# Altium schematic sheet Sensors.SchDoc: Gimbal - Sensors
size Letter; DrawnBy: Lance Bantoto; Organization: UW Robotics; Address1: 200 University Avenue; Address2: Waterloo; Address3: Ontario; Address4: Canada N2L 3G6; SheetNumber: 4; SheetTotal: 5
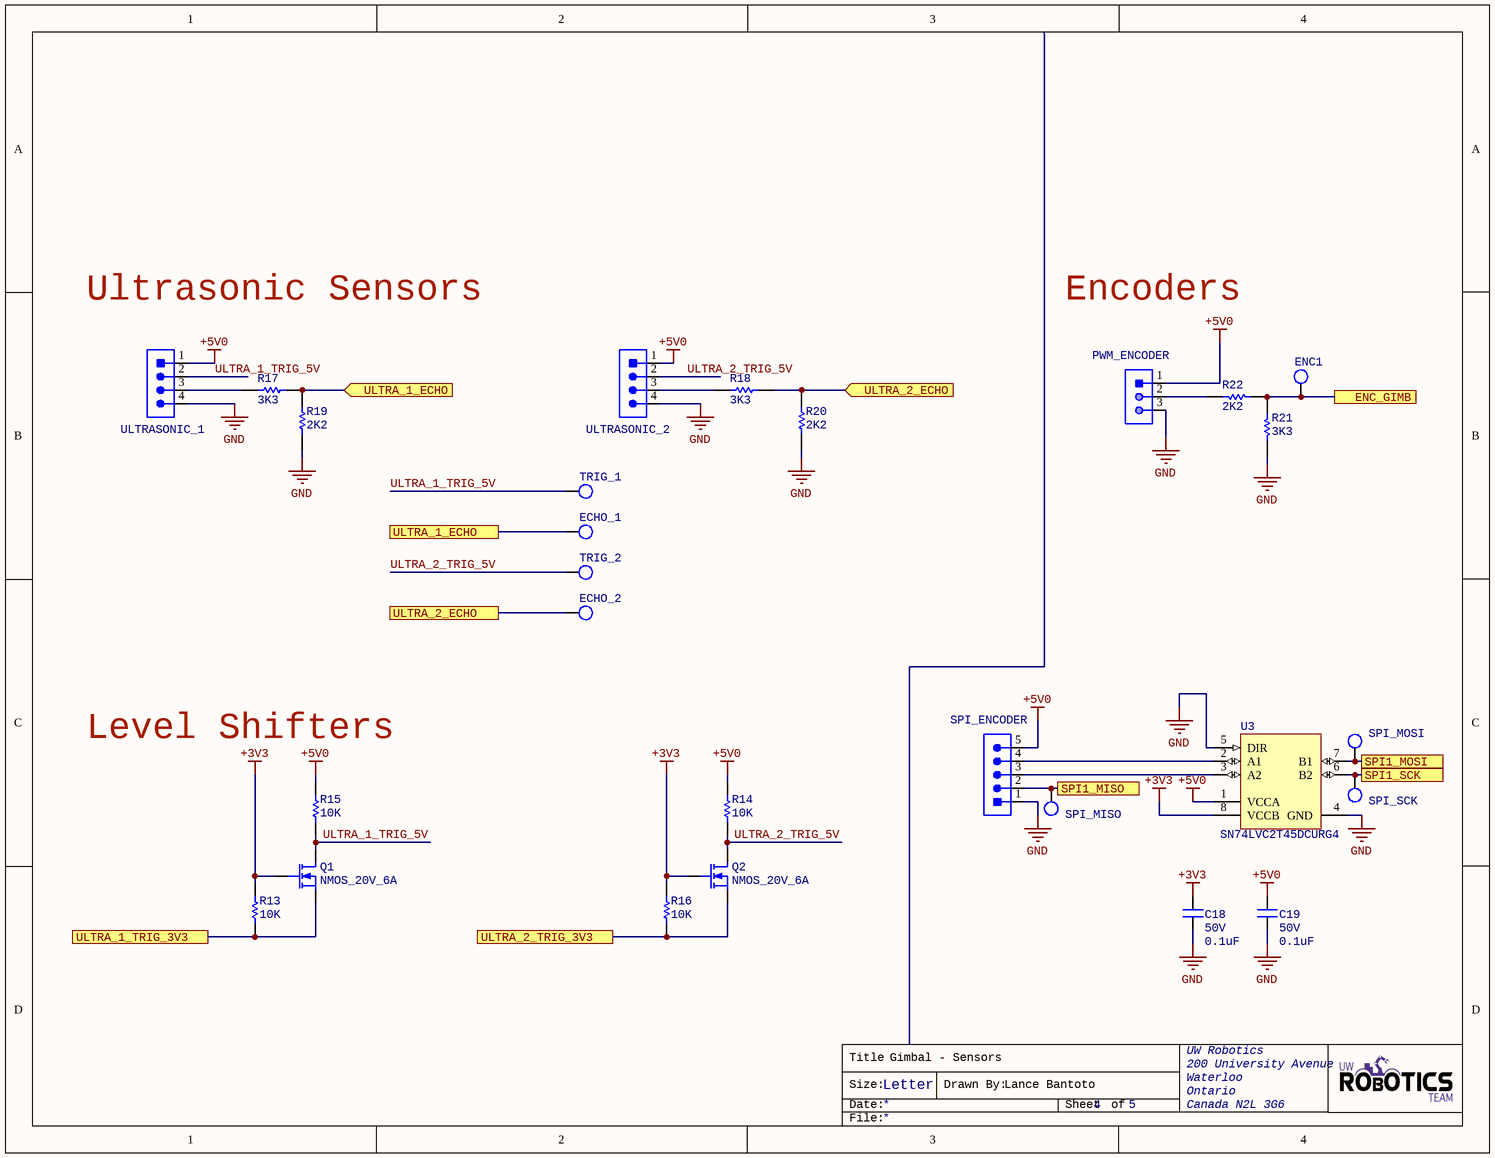
[diagram p0: Sensors.SchDoc]

## Parts
C18  value 0.1uF  Voltage Rating: 50V  [CAPC0603(1608)55_N]  (hidden comment: CAP_0.1uF_50V_0603)
C19  value 0.1uF  Voltage Rating: 50V  [CAPC0603(1608)55_N]  (hidden comment: CAP_0.1uF_50V_0603)
ECHO_1  TESTPOINT_LOOP  [TESTPOINT_LOOP]  (value not drawn)
ECHO_2  TESTPOINT_LOOP  [TESTPOINT_LOOP]  (value not drawn)
ENC1  TESTPOINT_LOOP  [TESTPOINT_LOOP]  (value not drawn)
PWM_ENCODER  CON_3M_SM4  [JST-B3B-SM4-TB]  (value not drawn)
Q1  NMOS_20V_6A  [NMOS_SOT23-3]
Q2  NMOS_20V_6A  [NMOS_SOT23-3]
R13  value 10K  [RESC0603(1608)_N]  (hidden comment: RES_10K_0603)
R14  value 10K  [RESC0603(1608)_N]  (hidden comment: RES_10K_0603)
R15  value 10K  [RESC0603(1608)_N]  (hidden comment: RES_10K_0603)
R16  value 10K  [RESC0603(1608)_N]  (hidden comment: RES_10K_0603)
R17  value 3K3  [RESC0603(1608)_N]  (hidden comment: RES_3K3_0603)
R18  value 3K3  [RESC0603(1608)_N]  (hidden comment: RES_3K3_0603)
R19  value 2K2  [RESC0603(1608)_N]  (hidden comment: RES_2K2_0603)
R20  value 2K2  [RESC0603(1608)_N]  (hidden comment: RES_2K2_0603)
R21  value 3K3  [RESC0603(1608)_N]  (hidden comment: RES_3K3_0603)
R22  value 2K2  [RESC0603(1608)_N]  (hidden comment: RES_2K2_0603)
SPI_ENCODER  CON_5M_SM4  [JST-B5B-SM4-TB]  (value not drawn)
SPI_MISO  TESTPOINT_LOOP  [TESTPOINT_LOOP]  (value not drawn)
SPI_MOSI  TESTPOINT_LOOP  [TESTPOINT_LOOP]  (value not drawn)
SPI_SCK  TESTPOINT_LOOP  [TESTPOINT_LOOP]  (value not drawn)
TRIG_1  TESTPOINT_LOOP  [TESTPOINT_LOOP]  (value not drawn)
TRIG_2  TESTPOINT_LOOP  [TESTPOINT_LOOP]  (value not drawn)
U3  SN74LVC2T45DCURG4  [DCU0008A_L]
ULTRASONIC_1  CON_4M_SM4  [JST-B4B-SM4-TB]  (value not drawn)
ULTRASONIC_2  CON_4M_SM4  [JST-B4B-SM4-TB]  (value not drawn)

## Ports
ENC_GIMB, SPI1_MISO, SPI1_MOSI, SPI1_SCK, ULTRA_1_ECHO, ULTRA_1_ECHO (in), ULTRA_1_TRIG_3V3, ULTRA_2_ECHO, ULTRA_2_ECHO (in), ULTRA_2_TRIG_3V3

## Nets
+3V3: C18.2 Q1.1(G) Q2.1(G) R13.1 R16.1 U3.8(VCCB)
+5V0: C19.2 PWM_ENCODER.1 R14.2 R15.2 SPI_ENCODER.5 U3.1(VCCA) ULTRASONIC_1.1 ULTRASONIC_2.1
GND: C18.1 C19.1 PWM_ENCODER.3 R19.1 R20.1 R21.2 SPI_ENCODER.1 U3.4(GND) U3.5(DIR) ULTRASONIC_1.4 ULTRASONIC_2.4
ENC_GIMB: ENC1.1 R21.1 R22.1 ; port ENC_GIMB
SPI1_MISO: SPI_ENCODER.2 SPI_MISO.1 ; port SPI1_MISO
SPI1_MOSI: SPI_MOSI.1 U3.7(B1) ; port SPI1_MOSI
SPI1_SCK: SPI_SCK.1 U3.6(B2) ; port SPI1_SCK
ULTRA_1_ECHO: ECHO_1.1 R17.1 R19.2 ; port ULTRA_1_ECHO
ULTRA_1_TRIG_3V3: Q1.2(S) R13.2 ; port ULTRA_1_TRIG_3V3
ULTRA_1_TRIG_5V: Q1.3(D) R15.1 TRIG_1.1 ULTRASONIC_1.2
ULTRA_2_ECHO: ECHO_2.1 R18.1 R20.2 ; port ULTRA_2_ECHO
ULTRA_2_TRIG_3V3: Q2.2(S) R16.2 ; port ULTRA_2_TRIG_3V3
ULTRA_2_TRIG_5V: Q2.3(D) R14.1 TRIG_2.1 ULTRASONIC_2.2
NetPWM_ENCODER_2: PWM_ENCODER.2 R22.2
NetR17_2: R17.2 ULTRASONIC_1.3
NetR18_2: R18.2 ULTRASONIC_2.3
NetSPI_ENCODER_3: SPI_ENCODER.3 U3.3(A2)
NetSPI_ENCODER_4: SPI_ENCODER.4 U3.2(A1)

## Notes on the sheet
- Ultrasonic Sensors
- Encoders
- (near R15) Level Shifters
- Title
- Size:
- Date:
- Letter
- Drawn By:
- Sheet
- of
- File:

## Library data of the parts
C18 C19 = CAP_0.1uF_50V_0603: CAP CER 0.1UF 50V X7R 0603; MPN: CC0603KRX7R9BB104; Manufacturer: Yageo; Dimensions: 0.063" L x 0.031" W (1.60mm x 0.80mm); Package: 0603 (1608 Metric); Temperature Coefficient: X7R; Supplier Part Number 1: 311-1344-1-ND; Supplier 1: Digi-Key
ECHO_1 ECHO_2 ENC1 SPI_MISO SPI_MOSI SPI_SCK TRIG_1 TRIG_2 = TESTPOINT_LOOP: Loop testpoint through-hole pad; Manufacturer: Keystone Electronics; Manufacturer Part Number 1: 5002; Supplier Part Number 1: 36-5002-ND; Supplier 1: Digi-Key
PWM_ENCODER = CON_3M_SM4: Manufacturer: JST; Manufacturer Part Number: B3B-PH-SM4-TB(LF)(SN); Max Current Rating: 2A; Max Voltage Rating: 100V; Pitch: 2mm; Supplier 1: Digi-Key; Supplier Part Number 1: 455-1735-1-ND; ComponentLink1URL: https://datasheet.ciiva.com/11747/0900766b80ddea81-11747684.pdf?src-supplier=RSComponents; ComponentLink1Description: https://datasheet.ciiva.com/11747/0900766b80ddea81-11747684.pdf?src-supplier=RSComponents
Q1 Q2 = NMOS_20V_6A: MOSFET N-CH 20V 6A SOT23; MPN: AO3420; Manufacturer: Alpha & Omega; Package: TO-236-3, SC-59, SOT-23-3; ComponentLink1Description: Datasheet; ComponentLink1URL: http://aosmd.com/res/data_sheets/AO3420.pdf; Supplier Part Number 1: 785-1014-1-ND; Supplier 1: Digi-Key
R13-R16 = RES_10K_0603: RES SMD 10K OHM 5% 1/10W 0603; Manufacturer: Yageo; MPN: RC0603JR-0710KL; Package: 0603 (1608 Metric); Dimensions: 0.063" L x 0.031" W (1.60mm x 0.80mm); Tolerance: 5%; Supplier Part Number 1: 311-10KGRCT-ND; Supplier 1: Digi-Key
R17 R18 R21 = RES_3K3_0603: RES SMD 3.3K OHM 5% 1/10W 0603; Manufacturer: Yageo; MPN: RC0603JR-073K3L; Dimensions: 0.063" L x 0.031" W (1.60mm x 0.80mm); Package: 0603 (1608 Metric); Tolerance: 5%; Digikey Part Number: 311-3.3KGRCT-ND; Supplier 1: Digi-Key; Supplier Part Number 1: 311-3.3KGRCT-ND
R19 R20 R22 = RES_2K2_0603: RES SMD 2.2K OHM 1% 1/10W 0603; Manufacturer: Yageo; MPN: RC0603FR-072K2L; Dimensions: 0.063" L x 0.031" W (1.60mm x 0.80mm); Package: 0603 (1608 Metric); Tolerance: 1%; Supplier Part Number 1: 311-2.20KHRCT-ND; Supplier 1: Digi-Key
SPI_ENCODER = CON_5M_SM4: Manufacturer: JST; Manufacturer Part Number: B5B-PH-SM4-TB(LF)(SN); Max Current Rating: 2A; Max Voltage Rating: 100V; Pitch: 2mm; Supplier 1: Digi-Key; ComponentLink1URL: https://datasheet.ciiva.com/11749/0900766b80ddea81-11749188.pdf?src-supplier=RSComponents; ComponentLink1Description: https://datasheet.ciiva.com/11749/0900766b80ddea81-11749188.pdf?src-supplier=RSComponents; ComponentLink2URL: https://datasheet.ciiva.com/712/eph-712595.pdf?src-supplier=Digi-Key; ComponentLink2Description: https://datasheet.ciiva.com/712/eph-712595.pdf?src-supplier=Digi-Key; ComponentLink3URL: https://datasheet.ciiva.com/712/eph-712596.pdf?src-supplier=Digi-Key; ComponentLink3Description: https://datasheet.ciiva.com/712/eph-712596.pdf?src-supplier=Digi-Key; ComponentLink4URL: https://datasheet.ciiva.com/730/eph-730612.pdf?src-supplier=Digi-Key; ComponentLink4Description: https://datasheet.ciiva.com/730/eph-730612.pdf?src-supplier=Digi-Key; ComponentLink5URL: https://datasheet.ciiva.com/16344/eph-16344920.pdf?src-supplier=Future+Electronics; ComponentLink5Description: https://datasheet.ciiva.com/16344/eph-16344920.pdf?src-supplier=Future+Electronics; Supplier Part Number 1: 455-1737-1-ND
U3 = CMP-0859-00013-4: Dual-Bit Dual Supply Transceiver with Configurable Voltage Translation and 3-State Outputs, DCU0008A, LARGE T&R; Manufacturer: Texas Instruments; tpd @ Nom Voltage(Max)(ns): 17.7,10.3,8.3,7.2; Logic: True; Rating: Military; ICC @ Nom Voltage(Max)(mA): 0.004; Bits(#): 2; 3-State Output: Yes; Schmitt Trigger: No; Technology Family: LVC; Sub-Family: Dual Supply Translator; Output Drive (IOL/IOH)(Max)(mA): 32/-32; Output Type: CMOS; VCC(Max)(V): 5.5; Input Type: CMOS/TTL; F @ Nom Voltage(Max)(Mhz): 150; VCC(Min)(V): 1.65; Voltage(Nom)(V): 1.8,2.5,3.3,5; PackageReference: DCU0008A; Generic Part Number: SN74LVC2T45; DatasheetVersion: SCES516J; Operating Temperature Range(C): -40 to 85
ULTRASONIC_1 ULTRASONIC_2 = CON_4M_SM4: Manufacturer: JST; Manufacturer Part Number: B4B-PH-SM4-TB(LF)(SN); Max Current Rating: 2A; Max Voltage Rating: 100V; Pitch: 2mm; ComponentLink1Description: https://datasheet.ciiva.com/8052/1699381-8052048.pdf?src-supplier=Element14; ComponentLink1URL: https://datasheet.ciiva.com/8052/1699381-8052048.pdf?src-supplier=Element14; Supplier 1: Digi-Key; Supplier Part Number 1: 455-1736-1-ND; ComponentLink2URL: https://datasheet.ciiva.com/11747/0900766b80ddea81-11747504.pdf?src-supplier=RSComponents; ComponentLink2Description: https://datasheet.ciiva.com/11747/0900766b80ddea81-11747504.pdf?src-supplier=RSComponents; ComponentLink3URL: https://datasheet.ciiva.com/6747/80567-6747409.pdf?src-supplier=Newark; ComponentLink3Description: https://datasheet.ciiva.com/6747/80567-6747409.pdf?src-supplier=Newark; ComponentLink4URL: https://datasheet.ciiva.com/727/eph-727525.pdf?src-supplier=Digi-Key; ComponentLink4Description: https://datasheet.ciiva.com/727/eph-727525.pdf?src-supplier=Digi-Key; ComponentLink5URL: https://datasheet.ciiva.com/712/eph-712582.pdf?src-supplier=Digi-Key; ComponentLink5Description: https://datasheet.ciiva.com/712/eph-712582.pdf?src-supplier=Digi-Key; ComponentLink6URL: https://datasheet.ciiva.com/712/eph-712583.pdf?src-supplier=Digi-Key; ComponentLink6Description: https://datasheet.ciiva.com/712/eph-712583.pdf?src-supplier=Digi-Key